# EAGLE design hi-link-ac-to-low-dc-general (EAGLE 7.6.0)
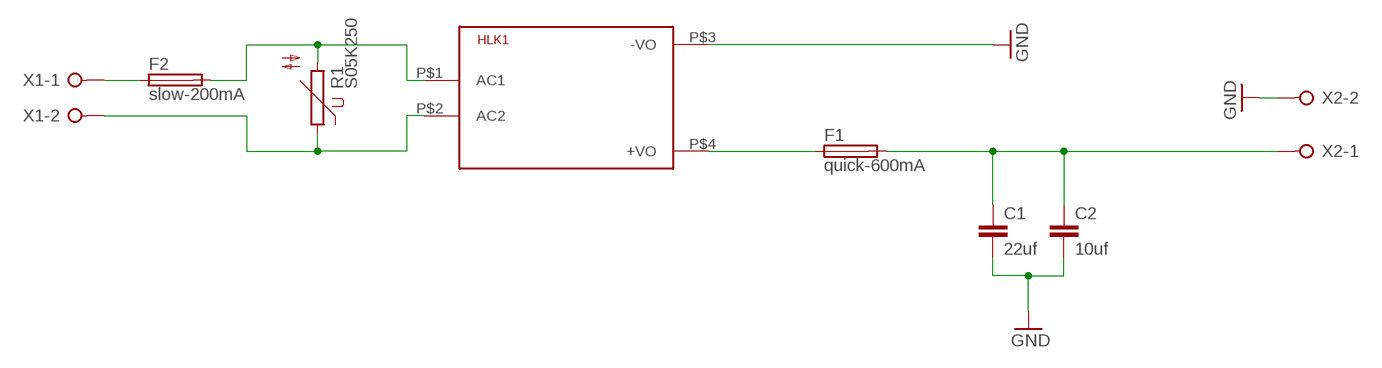
[diagram p0: schematic, sheet 1]

## Parts
C1  22uf  C-EUC1206  [C1206]
C2  10uf  C-EUC1206  [C1206]
F1  quick-600mA  SH22,5  [SH22,5]
F2  slow-200mA  SH22,5  [SH22,5]
HLK1  HLK-PM013W  [HLK-PM01]
R1  S05K250  [S05K250]
X1  W237-02P  [W237-132]
X2  W237-02P  [W237-132]

## Nets
GND: C1.2 C2.2 HLK1.P$3(-VO) X2.2
N$1: F2.1 X1.1
N$2: F2.2 HLK1.P$1(AC1) R1.2
N$3: C1.1 C2.1 F1.2 X2.1
N$4: F1.1 HLK1.P$4(+VO)
N$5: HLK1.P$2(AC2) R1.1 X1.2

## Library data of the parts
C1 C2 = rcl:C-EU: CAPACITOR, European symbol
F1 F2 = fuse:SH22,5: FUSE HOLDER grid 22,5 mm, OGN0031 8201, Schurter (Buerklin); MF: SCHURTER; MPN: 0031.8201; OC_FARNELL: 1162740; OC_NEWARK: 96F8317
HLK1 = HLK-PM01:HLK-PM01: Hi-Link Power Supply HLK-PM01 3W Author: Ahmed Said <https://github.com/AhmedSaid/EAGLELibraries>
R1 = varistor:S05K250: VARISTOR
X1 X2 = con-wago-508:W237-02P: WAGO SREW CLAMP; OC_FARNELL: unknown; OC_NEWARK: unknown

## Board
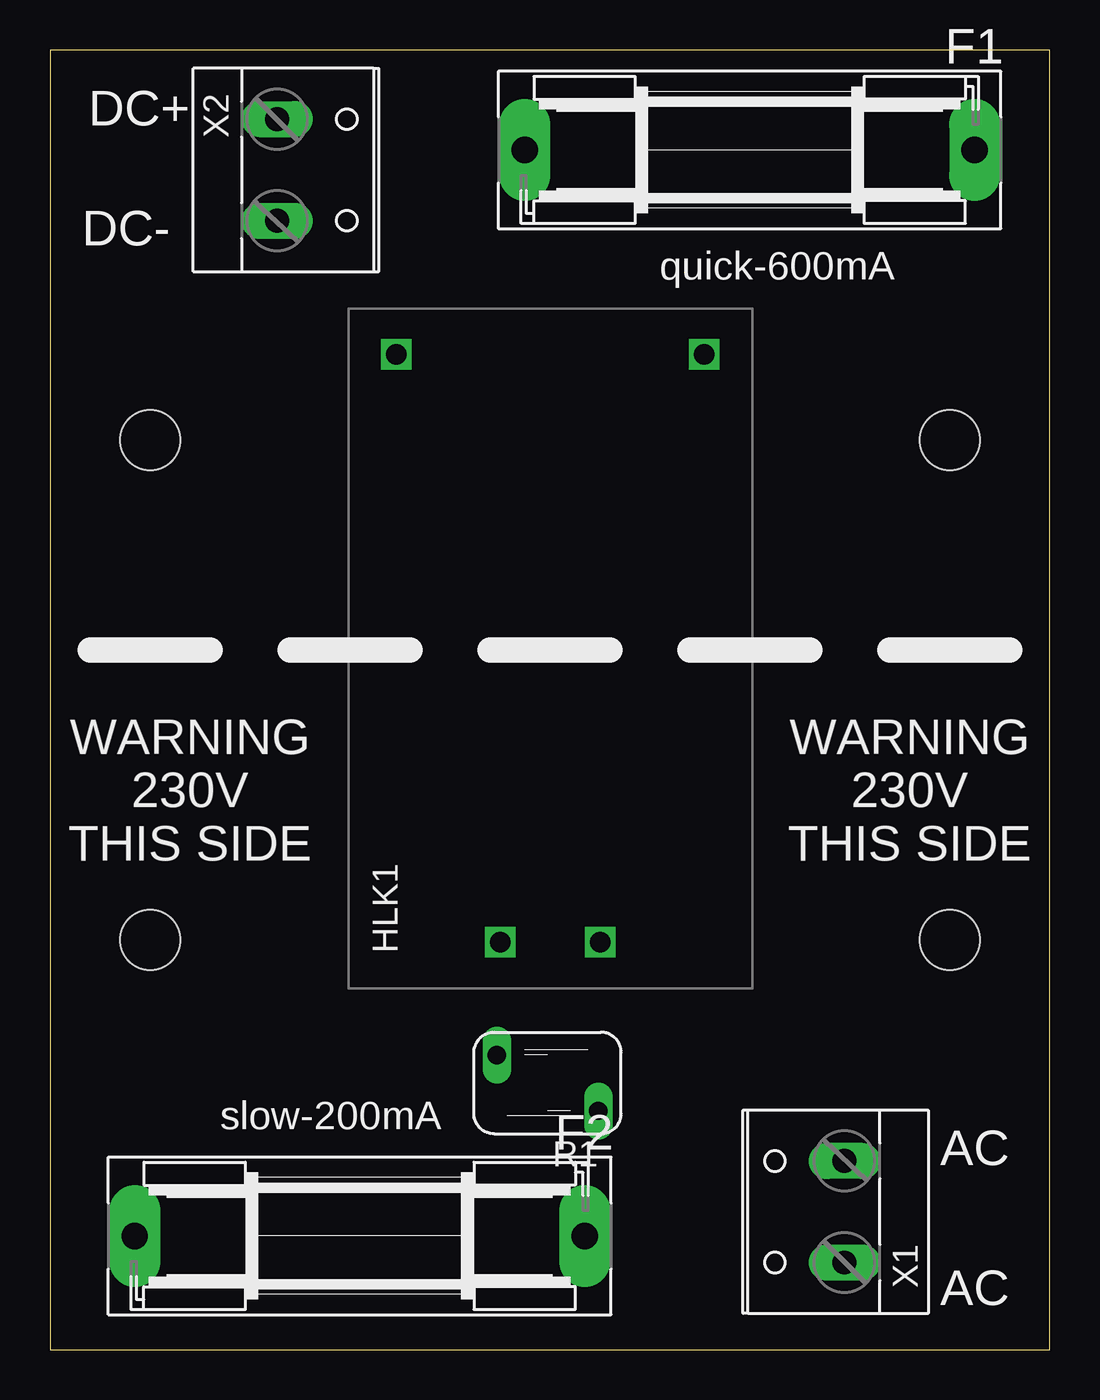
[diagram p1: board, top side]
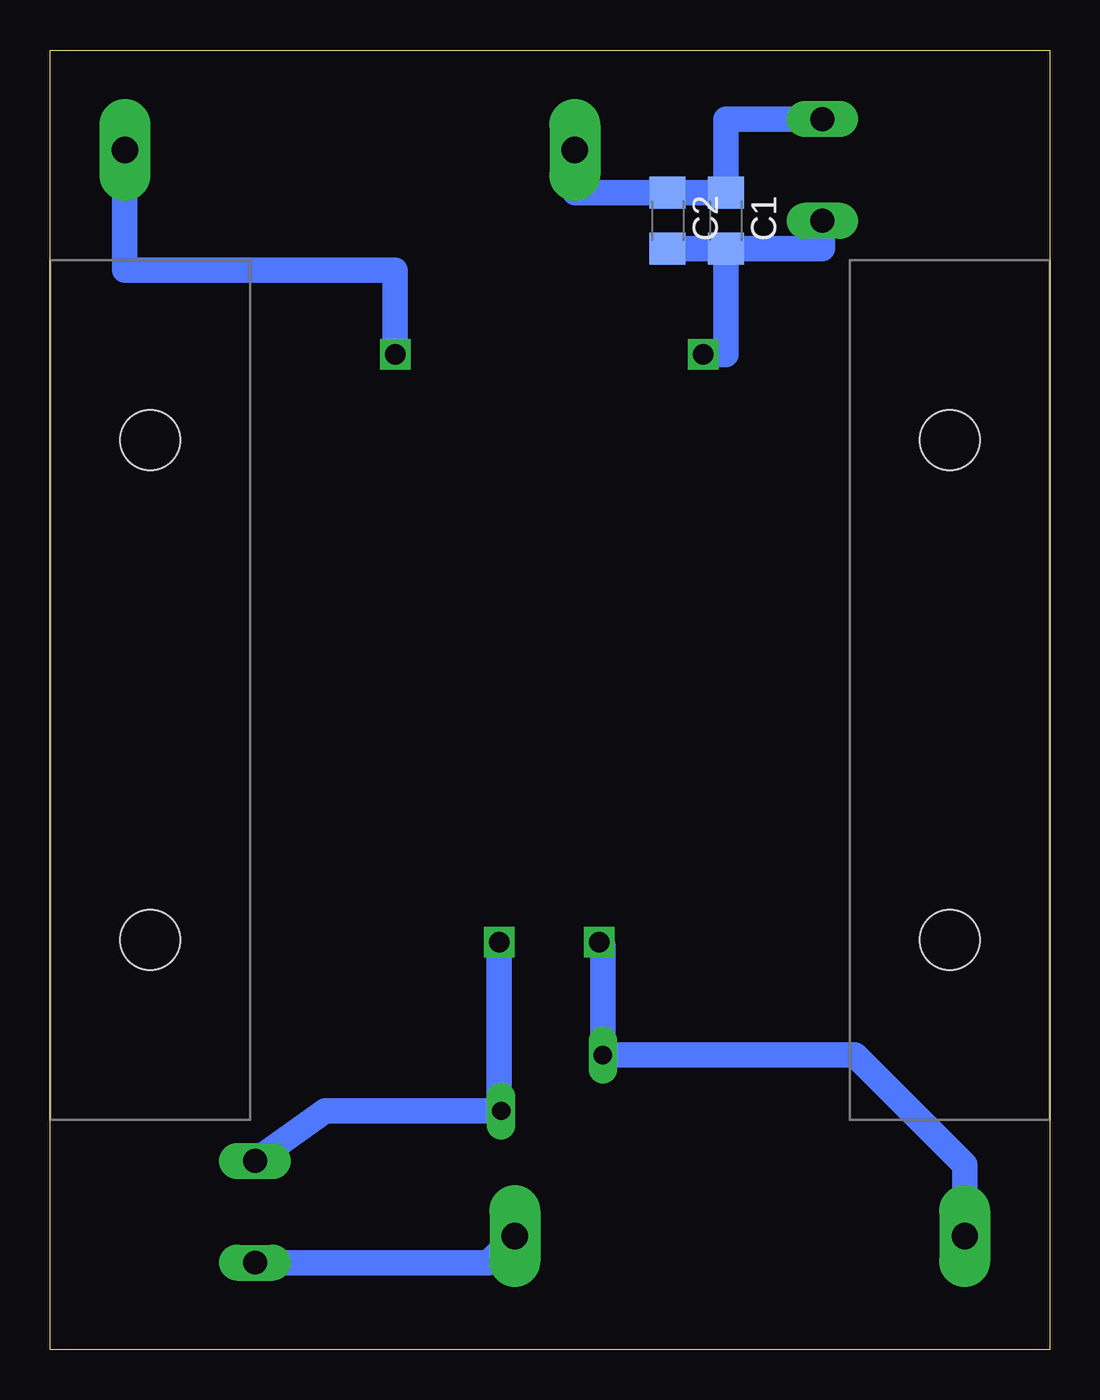
[diagram p2: board, bottom side, seen from below]

Size 50 x 65 mm. Coordinates in mm from the lower left corner, seen from the top.
Outline: 0,0 50,0 50,65 0,65 0,0
Copper layers (1*16): Top 0.035mm / dielectric 1.5mm / Bottom 0.035mm
Design rules "default": minimum track width 10mil, minimum drill 24mil, track to track 8mil, track to pad 8mil, pad to pad 8mil, via to via 8mil, smd to smd 8mil, copper to edge 40mil, drill to drill 8mil, minimum pad ring 10mil, minimum via ring 8mil, stop-mask expansion 4mil, vias tented up to drill 0mil, thermal gap 10mil

### Footprints (pad centres in the part's own frame; a part is rotated, then mirrored left to right if it is on the bottom)
C1206 = smd 1.6 x 1.8: 1 -1.4,0; 2 1.4,0
SH22,5 = drill 1.321 pad 2.54 long: 1 -11.252,0; 2 11.252,0
HLK-PM01 = drill 1.016 square: P$1 -14.7,2.5; P$2 -14.7,-2.5; P$3 14.7,7.7; P$4 14.7,-7.7
S05K250 = drill 0.914 long: 1 -1.397,-2.54; 2 1.397,2.54
DIN-MOUNT-2-HOLE = hole 3: 0,12.5; 0,-12.5
W237-132 = drill 1.194 long: 1 -2.54,-0.635; 2 2.54,-0.635

### Placement (x,y rotation side)
C1  16.19,56.46 270 bottom
C2  19.11,56.46 270 bottom
F1  35,60 180 top
F2  15.49,5.68 180 top
HLK1  25.03,35.07 90 top
R1  24.89,13.33 90 top
U$1  [DIN-MOUNT-2-HOLE]  5,33 180 top
U$2  [DIN-MOUNT-2-HOLE]  45,33 0 top
X1  39.11,6.89 90 top
X2  12,59 270 top

### Tracks (layer width: path | path; a pad name or v marks a point on that pad's centre or on a via)
GND
  Bottom 1.27: HLK1.P$3 16.19,49.77 C1.2 | C1.2 C2.2 | X2.2 11.37,55.06 C1.2
N$1
  Bottom 1.27: X1.1 28.07,4.35 F2.1
N$2
  Bottom 1.27: HLK1.P$1 22.35,20.19 R1.2 9.73,14.73 4.24,9.24 F2.2
N$3
  Bottom 1.27: X2.1 16.19,61.54 C1.1 C2.1 23.75,57.86 F1.2
N$4
  Bottom 1.27: F1.1 46.25,54 32.73,54 HLK1.P$4
N$5
  Bottom 1.27: X1.2 36.24,11.93 R1.1 27.53,12.03 HLK1.P$2

### Text on the board
_tsilk: DC+ | DC- | quick-600mA | WARNING / 230V / THIS SIDE | WARNING / 230V / THIS SIDE | slow-200mA | AC | AC
200bmp: 2020.05.08 / v1.0